# EAGLE design Arduino_project_board (EAGLE 7.1.0)
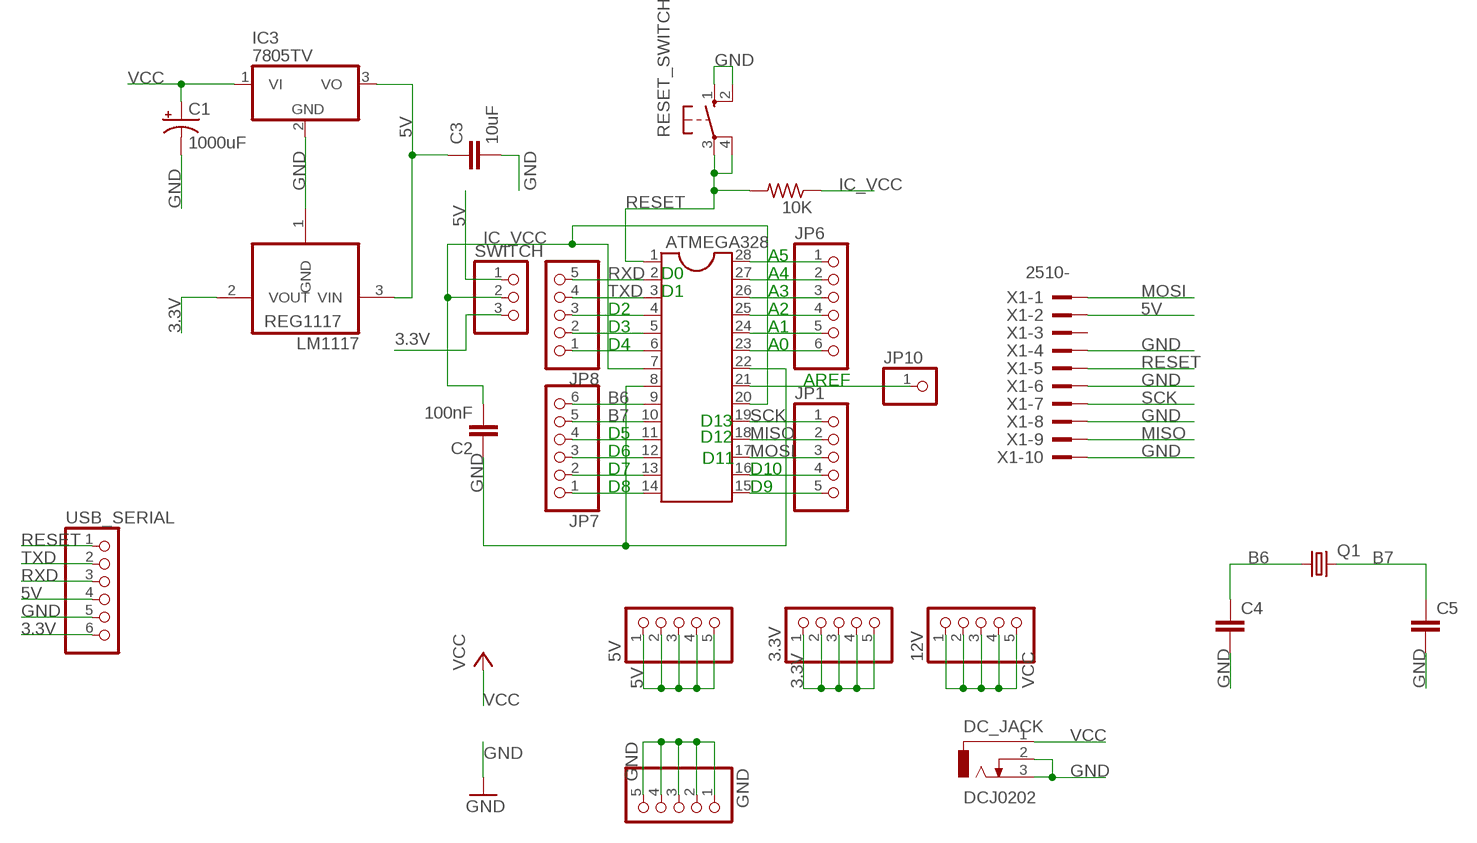
[diagram p0: schematic, sheet 1]

## Parts
3.3V  PINHD-1X5  [1X05]
5V  PINHD-1X5  [1X05]
10K  R-US_R0805  [R0805]
12V  PINHD-1X5  [1X05]
ATMEGA328  DIL28-4  [DIL28-4]
C1  1000uF  1000UF-25V(PTH)  [CPOL-RADIAL-1000UF-25V]
C2  100nF  C-EUC0805K  [C0805K]
C3  10uF  C-EUC0805K  [C0805K]
C4  C-EUC0805K  [C0805K]
C5  C-EUC0805K  [C0805K]
DC_JACK  DCJ0202  [DCJ0202]
GND  PINHD-1X5  [1X05]
IC3  7805TV  [TO220V]
JP1  PINHD-1X5  [1X05]
JP6  PINHD-1X6  [1X06]
JP7  PINHD-1X6  [1X06]
JP8  PINHD-1X5  [1X05]
JP10  PINHD-1X1  [1X01]
LM1117  REG1117  [SOT223]
Q1  CRYSTALHC49S  [HC49/S]
RESET_SWITCH  10-XX  [B3F-10XX]
SWITCH  PINHD-1X3  [1X03]
USB_SERIAL  PINHD-1X6  [1X06]
X1  2510-  [PAK100/2500-10]

## Nets
3.3V: 3.3V.1 3.3V.2 3.3V.3 3.3V.4 3.3V.5 LM1117.2(VOUT) SWITCH.3 USB_SERIAL.6
5V: 5V.1 5V.2 5V.3 5V.4 5V.5 C3.1 IC3.3(VO) LM1117.3(VIN) SWITCH.1 USB_SERIAL.4 X1.2
B6: ATMEGA328.9 C4.1 JP7.6 Q1.1
B7: ATMEGA328.10 C5.1 JP7.5 Q1.2
GND: ATMEGA328.8 ATMEGA328.22 C1.- C2.1 C3.2 C4.2 C5.2 DC_JACK.2 DC_JACK.3 GND.1 GND.2 GND.3 GND.4 GND.5 IC3.2(GND) LM1117.1(GND) RESET_SWITCH.1(S) RESET_SWITCH.2(S1) USB_SERIAL.5 X1.4 X1.6 X1.8 X1.10
IC_VCC: 10K.1 ATMEGA328.7 ATMEGA328.20 C2.2 SWITCH.2
MISO: ATMEGA328.18 JP1.2 X1.9
MOSI: ATMEGA328.17 JP1.3 X1.1
N$1: ATMEGA328.28 JP6.1
N$2: ATMEGA328.27 JP6.2
N$3: ATMEGA328.26 JP6.3
N$4: ATMEGA328.25 JP6.4
N$5: ATMEGA328.24 JP6.5
N$6: ATMEGA328.23 JP6.6
N$7: ATMEGA328.15 JP1.5
N$8: ATMEGA328.16 JP1.4
N$12: ATMEGA328.21 JP10.1
N$15: ATMEGA328.4 JP8.3
N$16: ATMEGA328.5 JP8.2
N$17: ATMEGA328.6 JP8.1
N$20: ATMEGA328.11 JP7.4
N$21: ATMEGA328.12 JP7.3
N$22: ATMEGA328.13 JP7.2
N$23: ATMEGA328.14 JP7.1
RESET: 10K.2 ATMEGA328.1 RESET_SWITCH.3(P) RESET_SWITCH.4(P1) USB_SERIAL.1 X1.5
RXD: ATMEGA328.2 JP8.5 USB_SERIAL.3
SCK: ATMEGA328.19 JP1.1 X1.7
TXD: ATMEGA328.3 JP8.4 USB_SERIAL.2
VCC: 12V.1 12V.2 12V.3 12V.4 12V.5 C1.+ DC_JACK.1 IC3.1(VI)
Unconnected: X1.3

## Notes on the sheet
- A5
- D0 | A4
- D1 | A3
- D2 | A2
- D3 | A1
- D4 | A0
- AREF
- D13
- D5 | D12
- D6
- D11
- D7 | D10
- D8 | D9

## Library data of the parts
3.3V 5V 12V GND JP1 JP8 = pinhead:PINHD-1X5: PIN HEADER
10K = resistor:R-US_: RESISTOR, American symbol
ATMEGA328 = ic-package:DIL28: Dual In Line
C1 = SparkFun-Capacitors:1000UF-25V(PTH): CAP-08070; PROD_ID: CAP-09538; VALUE: CAP-09538
C2-C5 = resistor:C-EU: CAPACITOR, European symbol
DC_JACK = con-jack:DCJ0202: DC POWER JACK Source: DCJ0202.pdf; OC_FARNELL: unknown; OC_NEWARK: unknown
IC3 = linear:78*: Positive VOLTAGE REGULATOR Source: http://cache.national.com/ds/LM/LM78L05.pdf http://www.fairchildsemi.com/ds/LM/LM7805.pdf
JP6 JP7 USB_SERIAL = pinhead:PINHD-1X6: PIN HEADER
JP10 = pinhead:PINHD-1X1: PIN HEADER
LM1117 = burr-brown:REG1117: 800mA and 1A Low Dropout (LDO) Positive Regulator 1.8V, 2.5V, 2.85V, 3.3V, 5V, and Adj; MPN: REG1117; OC_FARNELL: 1097566; OC_NEWARK: 14P6981
Q1 = crystal:CRYSTAL: CRYSTAL; OC_FARNELL: 1667008; OC_NEWARK: unknown
RESET_SWITCH = switch-omron:10-XX: OMRON SWITCH; MPN: B3F-1000; OC_FARNELL: 176432; OC_NEWARK: 36M3542
SWITCH = pinhead:PINHD-1X3: PIN HEADER
X1 = con-3m:2510-: 3M (TM) Pak 100 4-Wall Header Source: 3M; MF: 3M; MPN: 2510-6002UB; OC_FARNELL: 9838244; OC_NEWARK: 46F4725

## Board
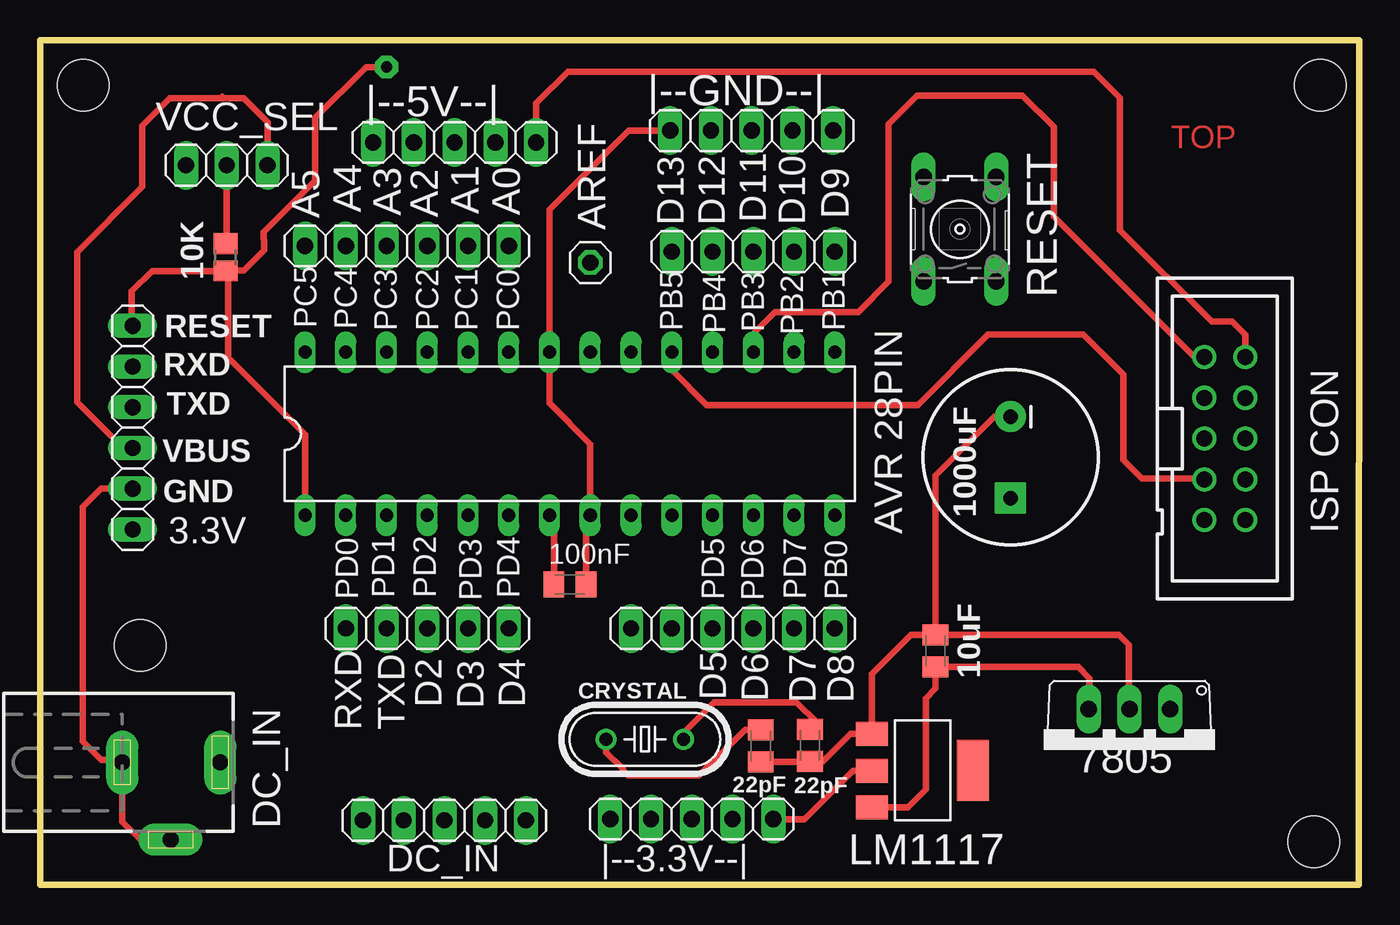
[diagram p1: board, top side]
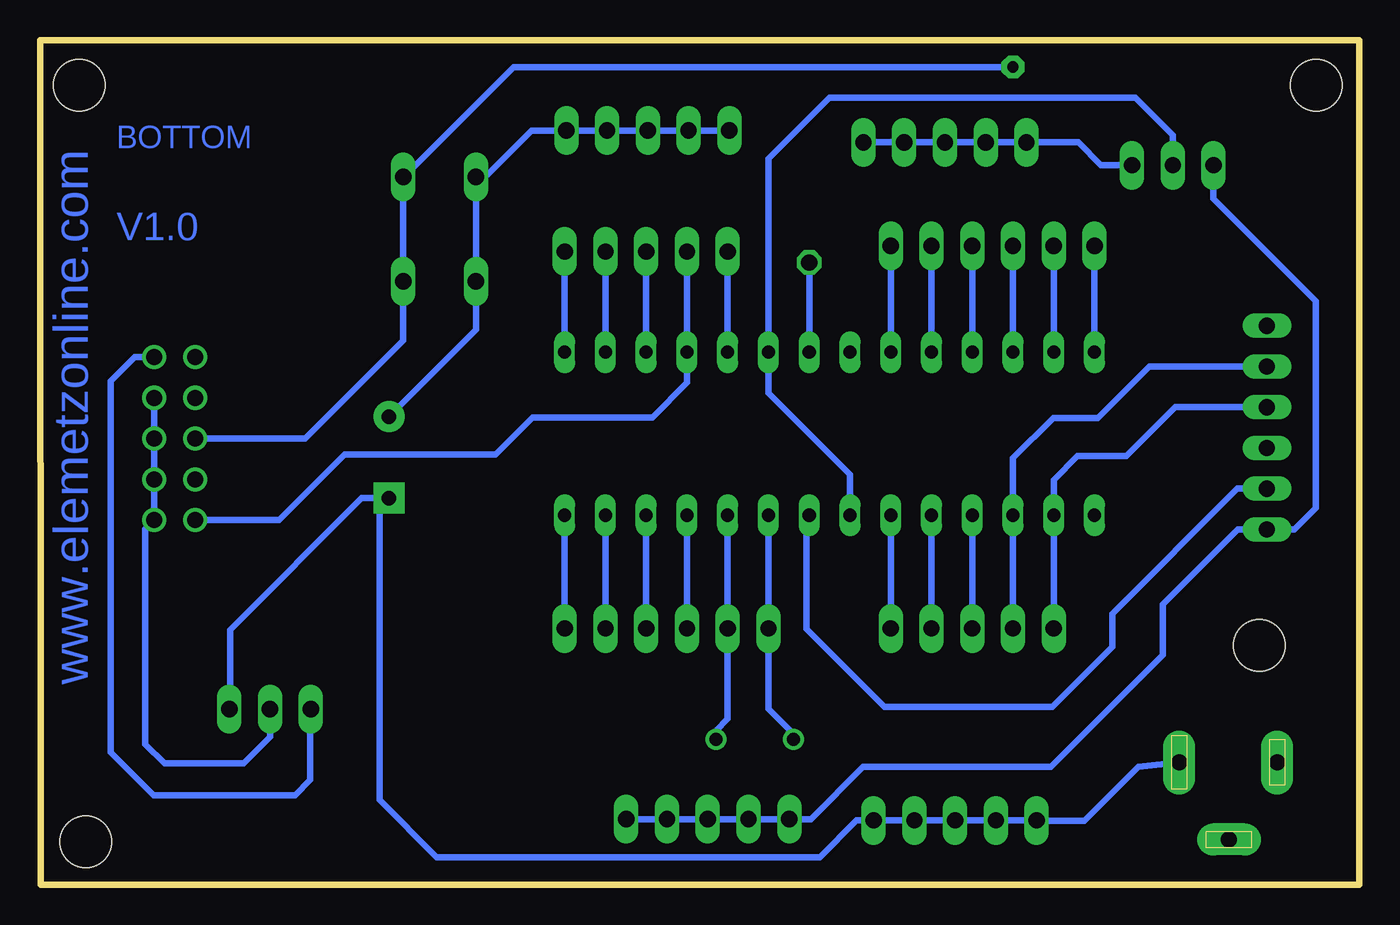
[diagram p2: board, bottom side, seen from below]

Size 82.23 x 52.65 mm. Coordinates in mm from the lower left corner, seen from the top.
Outline: 0,0 82.17,0 82.22,52.65 0,52.65 0,0
Copper layers (1*16): Top 0.035mm / dielectric 1.5mm / Bottom 0.035mm
Design rules "default": minimum track width 16mil, minimum drill 24mil, track to track 16mil, track to pad 24mil, pad to pad 16mil, via to via 16mil, smd to smd 16mil, copper to edge 40mil, drill to drill 8mil, minimum pad ring 10mil, minimum via ring 8mil, stop-mask expansion 4mil, vias tented up to drill 0mil, thermal gap 10mil
Holes 3.2 mm at 2.69,49.83 79.38,2.67 79.78,49.83 6.25,14.94

### Footprints (pad centres in the part's own frame; a part is rotated, then mirrored left to right if it is on the bottom)
1X05 = drill 1.016 long: 1 -5.08,0; 2 -2.54,0; 3 0,0; 4 2.54,0; 5 5.08,0
R0805 = smd 1.3 x 1.5: 1 -0.85,0; 2 0.85,0
DIL28-4 = drill 0.813 long: 1 -16.51,-5.08; 2 -13.97,-5.08; 3 -11.43,-5.08; 4 -8.89,-5.08; 5 -6.35,-5.08; 6 -3.81,-5.08; 7 -1.27,-5.08; 8 1.27,-5.08; 9 3.81,-5.08; 10 6.35,-5.08; 11 8.89,-5.08; 12 11.43,-5.08; 13 13.97,-5.08; 14 16.51,-5.08; 15 16.51,5.08; 16 13.97,5.08; 17 11.43,5.08; 18 8.89,5.08; 19 6.35,5.08; 20 3.81,5.08; 21 1.27,5.08; 22 -1.27,5.08; 23 -3.81,5.08; 24 -6.35,5.08; 25 -8.89,5.08; 26 -11.43,5.08; 27 -13.97,5.08; 28 -16.51,5.08
CPOL-RADIAL-1000UF-25V = drill 0.9 pad 1.93 square: + 2.54,0 | drill 0.9 pad 1.93: - -2.54,0
C0805K = smd 1.3 x 1.6: 1 -1,0; 2 1,0
DCJ0202 = drill 1 pad 2 long: 1 0,3.1; 2 4.8,0; 3 0,-3
TO220V = drill 1.016 long: 1 -2.54,-2.54; 2 0,-2.54; 3 2.54,-2.54
1X06 = drill 1.016 long: 1 -6.35,0; 2 -3.81,0; 3 -1.27,0; 4 1.27,0; 5 3.81,0; 6 6.35,0
1X01 = drill 1.016 octagon: 1 0,0
SOT223 = smd 1.499 x 2.007: 1 -2.261,-3.15; 2 0.025,-3.15; 3 2.311,-3.15 | smd 3.81 x 2.007: 4 0,3.15
HC49/S = drill 0.813: 1 -2.413,0; 2 2.413,0
B3F-10XX = drill 1.016 long: 1 -3.251,2.261; 2 3.251,2.261; 3 -3.251,-2.261; 4 3.251,-2.261
1X03 = drill 1.016 long: 1 -2.54,0; 2 0,0; 3 2.54,0
PAK100/2500-10 = drill 1 pad 1.422: 1 -5.08,-1.27; 2 -5.08,1.27; 3 -2.54,-1.27; 4 -2.54,1.27; 5 0,-1.27; 6 0,1.27; 7 2.54,-1.27; 8 2.54,1.27; 9 5.08,-1.27; 10 5.08,1.27

### Placement (x,y rotation side)
3.3V  40.61,4.09 0 top
5V  25.83,46.28 0 top
10K  11.56,39.12 270 top
12V  25.2,4.01 0 top
ATMEGA328  33.02,28.12 0 top
C1  60.48,26.64 270 top
C2  33.02,18.72 180 top
C3  55.8,14.58 90 top
C4  44.91,8.66 270 top
C5  47.98,8.69 270 top
DC_JACK  8.13,7.62 270 top
GND  44.35,47.02 0 top
IC3  67.89,8.41 180 top
JP1  44.45,39.47 0 top
JP6  22.86,39.83 0 top
JP7  43.18,15.98 180 top
JP8  24.13,15.98 180 top
JP10  34.29,38.79 0 top
LM1117  54.99,7.14 270 top
Q1  37.69,9.07 0 top
RESET_SWITCH  57.33,40.87 90 top
SWITCH  11.63,44.86 180 top
USB_SERIAL  5.77,28.5 270 top
X1  73.84,27.81 270 top

### Tracks (layer width: path | path; a pad name or v marks a point on that pad's centre or on a via)
3.3V
  Top 0.406: 3.3V.5 47.65,4.09 50.67,7.11 LM1117.2
  Bottom 0.406: 3.3V.5 3.3V.4 3.3V.3 3.3V.2 3.3V.1 34.19,4.09 30.94,7.34 19.23,7.34 12.24,14.33 12.24,17.47 7.57,22.15 USB_SERIAL.6 4.06,22.15 2.72,23.49 2.72,36.4 9.09,42.77 SWITCH.3
5V
  Top 0.406: LM1117.3 54.08,4.83 55.19,5.94 55.19,11.63 55.8,12.24 C3.1 64.7,13.58 65.41,12.88 65.41,11 IC3.3 | USB_SERIAL.4 5.18,27.23 2.31,30.1 2.31,39.45 6.38,43.51 6.38,47.32 8.08,49.02 11.25,49.02 | 11.25,49.02 11.35,49.12 | 75.16,32.94 X1.2 75.11,34.29 74.3,35.1 73.03,35.1 67.31,40.82 67.31,49.07 65.68,50.7 32.89,50.7 30.91,48.72 5V.5 | SWITCH.1 14.17,47.55 12.68,49.05 12.65,49.02 11.25,49.02
  Bottom 0.406: 5V.5 5V.4 5V.3 5V.2 5V.1 17.53,46.28 16.1,44.86 SWITCH.1 | X1.2 76.33,32.89 77.83,31.39 77.83,8.25 75.16,5.59 66.34,5.59 65.41,6.53 65.41,10.9 IC3.3
B6
  Top 0.406: C4.1 43.93,9.66 41.07,6.81 36.65,6.81 36.3,7.16 36.3,7.19 36.32,7.21 35.28,8.25 Q1.1
  Bottom 0.406: ATMEGA328.9 JP7.6 36.83,10.97 35.28,9.42 Q1.1
B7
  Top 0.406: C5.1 48.44,10.08 47.14,11.38 42.01,11.38 40.11,9.47 Q1.2
  Bottom 0.406: ATMEGA328.10 JP7.5 39.37,10.34 40.11,9.6 Q1.2
GND
  Top 0.406: C2.1 34.02,21.77 | 34.02,21.77 34.02,22.13 34.29,22.4 | 34.02,21.77 34.29,22.04 ATMEGA328.8 34.29,27.48 31.75,30.02 ATMEGA328.22 31.75,42.09 36.68,47.02 GND.1 | C3.2 54.26,15.58 51.84,13.16 LM1117.1 50.49,9.4 48.78,7.69 C5.2 47.95,7.66 C4.2 | C3.2 67.22,15.58 67.84,14.96 67.84,12.9 IC3.2 | C3.2 55.8,25.5 59.49,29.18 C1.- | USB_SERIAL.5 3.81,24.69 2.67,23.55 2.67,8.94 3.81,7.8 4.95,7.8 DC_JACK.3 5.13,3.94 6.35,2.72 8.03,2.72 DC_JACK.2
  Bottom 0.406: GND.1 GND.2 GND.3 GND.4 GND.5 51.59,47.02 54.48,44.12 RESET_SWITCH.2 RESET_SWITCH.1 55.07,34.59 C1.- | X1.4 X1.6 X1.8 X1.10 75.67,22.17 75.67,8.76 74.47,7.57 69.55,7.57 67.89,9.22 IC3.2 | USB_SERIAL.5 7.59,24.69 15.39,16.89 15.39,14.83 19.13,11.1 29.62,11.1 34.47,15.95 34.47,22.86 ATMEGA328.8
IC_VCC
  Top 0.406: C2.2 32.02,22.77 ATMEGA328.7 | SWITCH.2 11.63,40.04 10K.1
  Bottom 0.406: SWITCH.2 11.63,46.74 13.97,49.07 33.02,49.07 36.83,45.26 ATMEGA328.20 36.83,30.66 31.75,25.58 ATMEGA328.7
MISO
  Bottom 0.406: JP1.2 ATMEGA328.18 41.91,31.29 44.07,29.13 51.54,29.13 53.85,26.82 63.25,26.82 67.33,22.73 X1.9
MOSI
  Top 0.406: X1.1 71.93,32.89 63.17,41.66 63.17,47.24 61.21,49.2 54.66,49.2 52.88,47.42 52.88,37.59 51,35.71 45.8,35.71 44.45,34.37 ATMEGA328.17
  Bottom 0.406: ATMEGA328.17 JP1.3
N$1
  Bottom 0.406: ATMEGA328.28 JP6.1
N$2
  Bottom 0.406: ATMEGA328.27 JP6.2
N$3
  Bottom 0.406: ATMEGA328.26 JP6.3
N$4
  Bottom 0.406: ATMEGA328.25 JP6.4
N$5
  Bottom 0.406: ATMEGA328.24 JP6.5
N$6
  Bottom 0.406: ATMEGA328.23 JP6.6
N$7
  Bottom 0.406: ATMEGA328.15 JP1.5
N$8
  Bottom 0.406: ATMEGA328.16 JP1.4
N$12
  Bottom 0.406: ATMEGA328.21 JP10.1
N$15
  Bottom 0.406: ATMEGA328.4 JP8.3
N$16
  Bottom 0.406: ATMEGA328.5 JP8.2
N$17
  Bottom 0.406: ATMEGA328.6 JP8.1
N$20
  Bottom 0.406: ATMEGA328.11 JP7.4
N$21
  Bottom 0.406: ATMEGA328.12 JP7.3
N$22
  Bottom 0.406: ATMEGA328.13 JP7.2
N$23
  Bottom 0.406: ATMEGA328.14 JP7.1
RESET  (via drill 0.7 pad 1.42)
  Top 0.406: 10K.2 6.97,38.27 5.71,37.01 5.71,34.9 USB_SERIAL.1 | ATMEGA328.1 16.51,28.07 11.71,32.87 11.71,38.11 10K.2 | 10K.2 12.7,38.28 13.97,39.55 13.97,40.18 13.95,40.21 13.95,40.69 17.14,43.89 17.14,47.8 20.32,50.98 v21.59,50.98
  Bottom 0.406: RESET_SWITCH.3 RESET_SWITCH.4 | RESET_SWITCH.3 59.59,33.93 65.71,27.81 X1.5 | RESET_SWITCH.3 59.59,44.09 52.7,50.98 v21.59,50.98
RXD
  Bottom 0.406: JP8.5 ATMEGA328.2 19.05,25.25 17.58,26.72 14.53,26.72 14.38,26.87 14.19,27.06 11.48,29.77 USB_SERIAL.3
SCK
  Top 0.406: ATMEGA328.19 39.37,32.08 41.53,29.92 54.71,29.92 59.08,34.29 65.02,34.29 67.51,31.8 67.51,26.47 68.66,25.32 72.52,25.32 X1.7
  Bottom 0.406: ATMEGA328.19 JP1.1
TXD
  Bottom 0.406: JP8.4 ATMEGA328.3 21.59,26.59 19.07,29.11 16.31,29.11 13.11,32.31 USB_SERIAL.2
VCC
  Bottom 0.406: DC_JACK.1 13.77,7.36 17.14,3.99 20.09,3.99 12V.1 12V.2 12V.3 12V.4 12V.5 31.34,4.01 33.63,1.73 57.51,1.73 61.06,5.28 61.06,23.52 C1.+ 62.18,24.1 70.38,15.9 70.38,12.9 IC3.1

### Text on the board
Top: TOP
Bottom: BOTTOM | www.elemetzonline.com | V1.0
tPlace: D5
tNames: |--5V--| | |--GND--| | VCC_SEL | A4 | A3 | A1 | A0 | A5 | A2 | AREF | D13 | D12 | D11 | D10 | D9 | 10K | RESET | RESET | PC5 | PC4 | PC3 | PC2 | PC1 | PC0 | PB5 | PB4 | PB3 | PB2 | PB1 | RXD | TXD | VBUS | GND | 1000uF | AVR 28PIN | ISP CON | 3.3V | 100nF | PD0 | PD1 | PD2 | PD3 | PD4 | PD5 | PD6 | PD7 | PB0 | 10uF | CRYSTAL | D2 | D3 | D4 | D6 | D7 | D8 | RXD | TXD | 7805 | 22pF | 22pF | DC_IN | LM1117 | DC_IN | |--3.3V--|